# EAGLE design relayBoardSingleSMD (EAGLE 7.6.0)
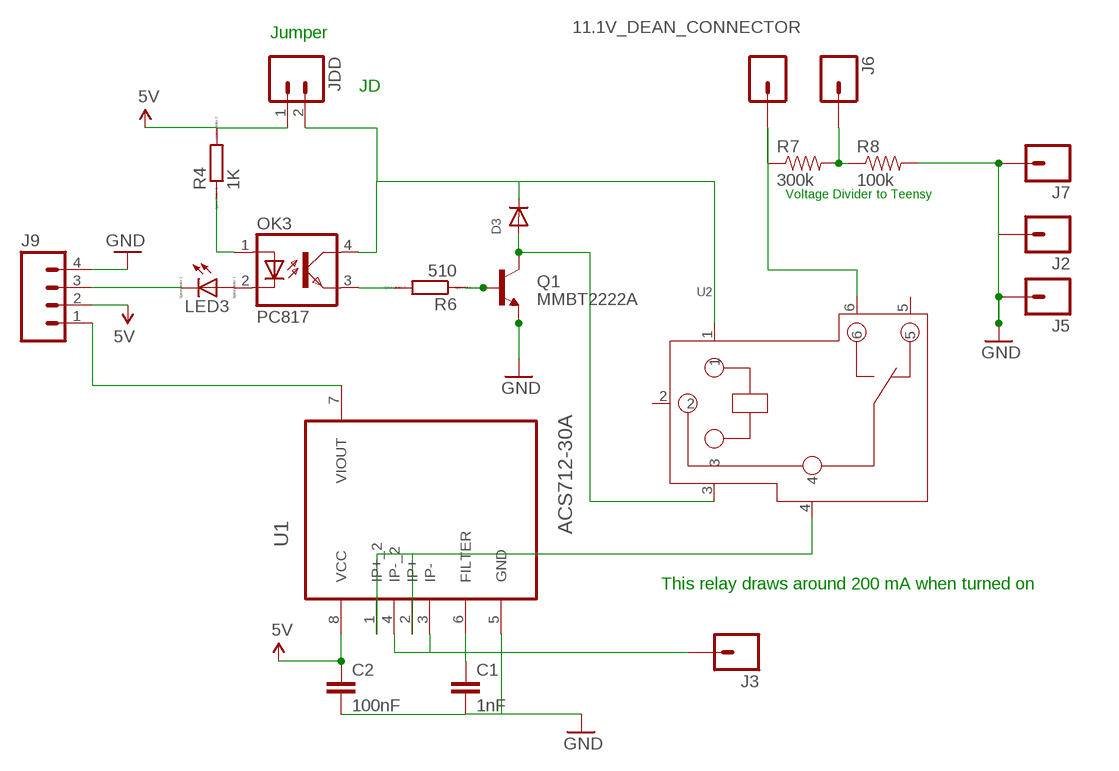
[diagram p0: schematic, sheet 1]

## Parts
11.1V_DEAN_CONNECTOR  M01NOSILK-KIT  [1X01NS-KIT]
C1  1nF  CAP1206  [1206]
C2  100nF  CAP1206  [1206]
D3  DIODEDO-1N4148  [DO-1N4148]
J2  M01NOSILK-KIT  [1X01NS-KIT]
J3  M01NOSILK-KIT  [1X01NS-KIT]
J5  M01NOSILK-KIT  [1X01NS-KIT]
J6  M01NOSILK-KIT  [1X01NS-KIT]
J7  M01NOSILK-KIT  [1X01NS-KIT]
J9  M04LOCK_LONGPADS  [1X04_LOCK_LONGPADS]
JDD  M02LOCK_LONGPADS  [1X02_LOCK_LONGPADS]
LED3  LED_E  [LED_1206]
OK3  PC817  [DIL04]
Q1  MMBT2222A  TRANSISTOR_NPNMMBT2222A  [SOT23-3]
R4  1K  RR1206  [R1206]
R6  510  RR1206  [R1206]
R7  300k  RESISTOR1206  [1206]
R8  100k  RESISTOR1206  [1206]
U1  ACS712-30A  ACS712ELCTR-20A-T  [SOIC127P600X175-8N]
U2  RELAY-SLA-05VDC-SL-C  [6P-19.8H]

## Nets
5V: C2.1 J9.2 JDD.1 R4.2 U1.8(VCC)
11.1V_BATTERY: 11.1V_DEAN_CONNECTOR.1 R7.1 U2.6
GND: C1.2 C2.2 J2.1 J5.1 J7.1 J9.4 Q1.2(E) R8.2 U1.5(GND)
N$19: LED3.A OK3.2(C)
N$20: OK3.1(A) R4.1
N$21: OK3.3(EMIT) R6.2
N$22: Q1.1(B) R6.1
N$23: D3.A Q1.3(C) U2.3
N$24: D3.C JDD.2 OK3.4(COL) U2.1
N$26: J3.1 U1.3(IP-) U1.4(IP-_2)
N$27: J9.3 LED3.C
N$68: C1.1 U1.6(FILTER)
N$69: J9.1 U1.7(VIOUT)
N$70: U1.1(IP+_2) U1.2(IP+) U2.4
VOLTAGE_DIVIDER_5V: J6.1 R7.2 R8.1
Unconnected: U2.2 U2.5

## Notes on the sheet
- Jumper
- JD
- Voltage Divider to Teensy
- This relay draws around 200 mA when turned on

## Library data of the parts
11.1V_DEAN_CONNECTOR J2 J3 J5-J7 = SparkFun-Connectors:M01: Header 1 Standard 1-pin 0.1" header. Use with straight break away headers (SKU : PRT-00116), right angle break away headers (PRT-00553), swiss pins (PRT-00743), machine pins (PRT-00117), and female headers (PRT-00115). SMTSO-256-ET is a "flush mount" nut for a 4-40 screw. The older package used to be too tight, and did not allow it to sit properly thru the drill hit. The latest (0.165DIA) fits nice and snug.
C1 C2 = SparkFun-Capacitors:CAP: Capacitor Standard 0603 ceramic capacitor, and 0.1" leaded capacitor.
D3 = adafruit:DIODE: Diode SMADIODE - SMA Surface Mount Package 20V 1A Schottky Diode Digikey: 641-1014-6-ND DO-1N4148 - Through Hole Small Current Diode SOD-123 20V 1 A (.5mV Vf) Schottky Diode - Digikey: MBRX120TPMSCT-ND SOD-323 10V 570mA (.38mV Vf, 3ns) Schottky Diode - Digikey: ZLLS410CT-ND SOD-523 30V 30mA Schottky Diode (RB751S-40TE61) - Digikey: RB751S-40TE61CT-ND SOT23-R/W - SOT23 Package (R = Solder Paste/Reflow Ovens, W = Hand-Soldering) BAT54Film 40V 300mA - Digikey: 497-7162-1-ND
J9 = SparkFun-Connectors:M04: Header 4 Standard 4-pin 0.1" header. Use with straight break away headers (SKU : PRT-00116), right angle break away headers (PRT-00553), swiss pins (PRT-00743), machine pins (PRT-00117), and female headers (PRT-00115). Molex polarized connector foot print use with SKU : PRT-08231 with associated crimp pins and housings. 1MM SMD Version SKU: PRT-10208; PROD_ID: CONN-09696
JDD = SparkFun-Connectors:M02: Standard 2-pin 0.1" header. Use with - straight break away headers ( PRT-00116) - right angle break away headers (PRT-00553) - swiss pins (PRT-00743) - machine pins (PRT-00117) - female headers (PRT-00115) Molex polarized connector foot print use with: PRT-08233 with associated crimp pins and housings. 2.54_SCREWTERM for use with PRT-10571. 3.5mm Screw Terminal footprints for PRT-08084 5mm Screw Terminal footprints for use with PRT-08432
LED3 = eagle-ltspice:LED_E: LED Source: http://www.osram.convergy.de Source: www.luxeon.com Source: www.kingbright.com; SPICEMODEL: NONE; SPICEPREFIX: D; SPICETYPE: diode
OK3 = optocoupler:PC817: SHARP OPTO COUPLER; MPN: PC817X4J000F; OC_FARNELL: 9707727; OC_NEWARK: 97K7059
Q1 = SparkFun-DiscreteSemi:TRANSISTOR_NPN: Generic NPN BJT MMBT2222A - TRANS-08049 (SOT-23, 1A 40V) MPSA42 - TRANS-09116 (SOT-23, 500mA 300V) MMBT5088LT1G - TRANS-11160 (SOT-23, 50 mA 30V) BC547 - COM-08928 <http://www.sparkfun.com/products/8928> (TO-92 45V 100mA) (1.Collector 2.Base 3.Emitter) 2N3904 - COM-00521 <http://www.sparkfun.com/products/521> (TO-92 40V 200mA) (1.Emitter 2.Base 3.Collector) P2N2222A - COM-12852 <http://www.sparkfun.com/products/12852> (TO-92 40V 600mA) (1.Collector 2.Base 3.Emitter); PROD_ID: TRANS-08049
R4 R6 = eagle-ltspice:R: RESISTOR, European symbol; SPICEMODEL: NONE; SPICEPREFIX: R
R7 R8 = SparkFun-Passives:RESISTOR: Resistor Basic schematic elements and footprints for 0603, 1206, and PTH resistors.
U1 = Allegro_By_element14_Batch_1:ACS712ELCTR-20A-T: Linear Current Sensor; MPN: ACS712ELCTR-20A-T; OC_FARNELL: 1329624; OC_NEWARK: 31M3133; PACKAGE: SOIC-8; SUPPLIER: Allegro
U2 = Grove ®C SPDT Relay(30A) v1.0:RELAY-SLA-05VDC-SL-C: · Up to 30A switching in SPST and 20A switching in spot arrangements. · Available as an open-frame relay, with a snap-on dust cover or with an immersion cleanable, plastic sealed case.

## Board
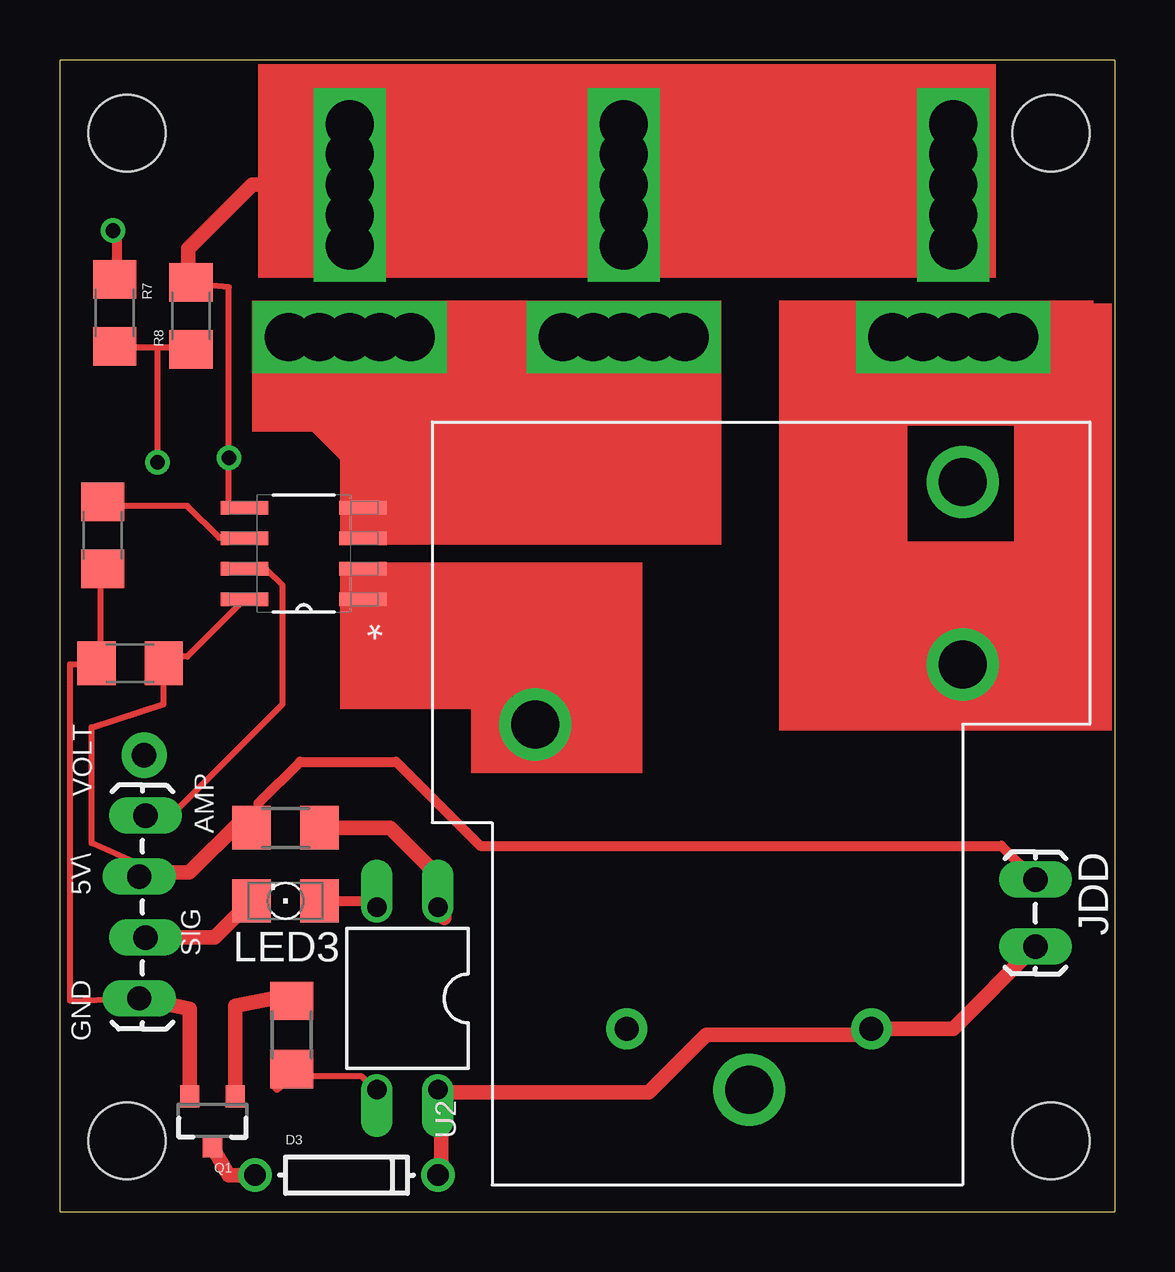
[diagram p1: board, top side]
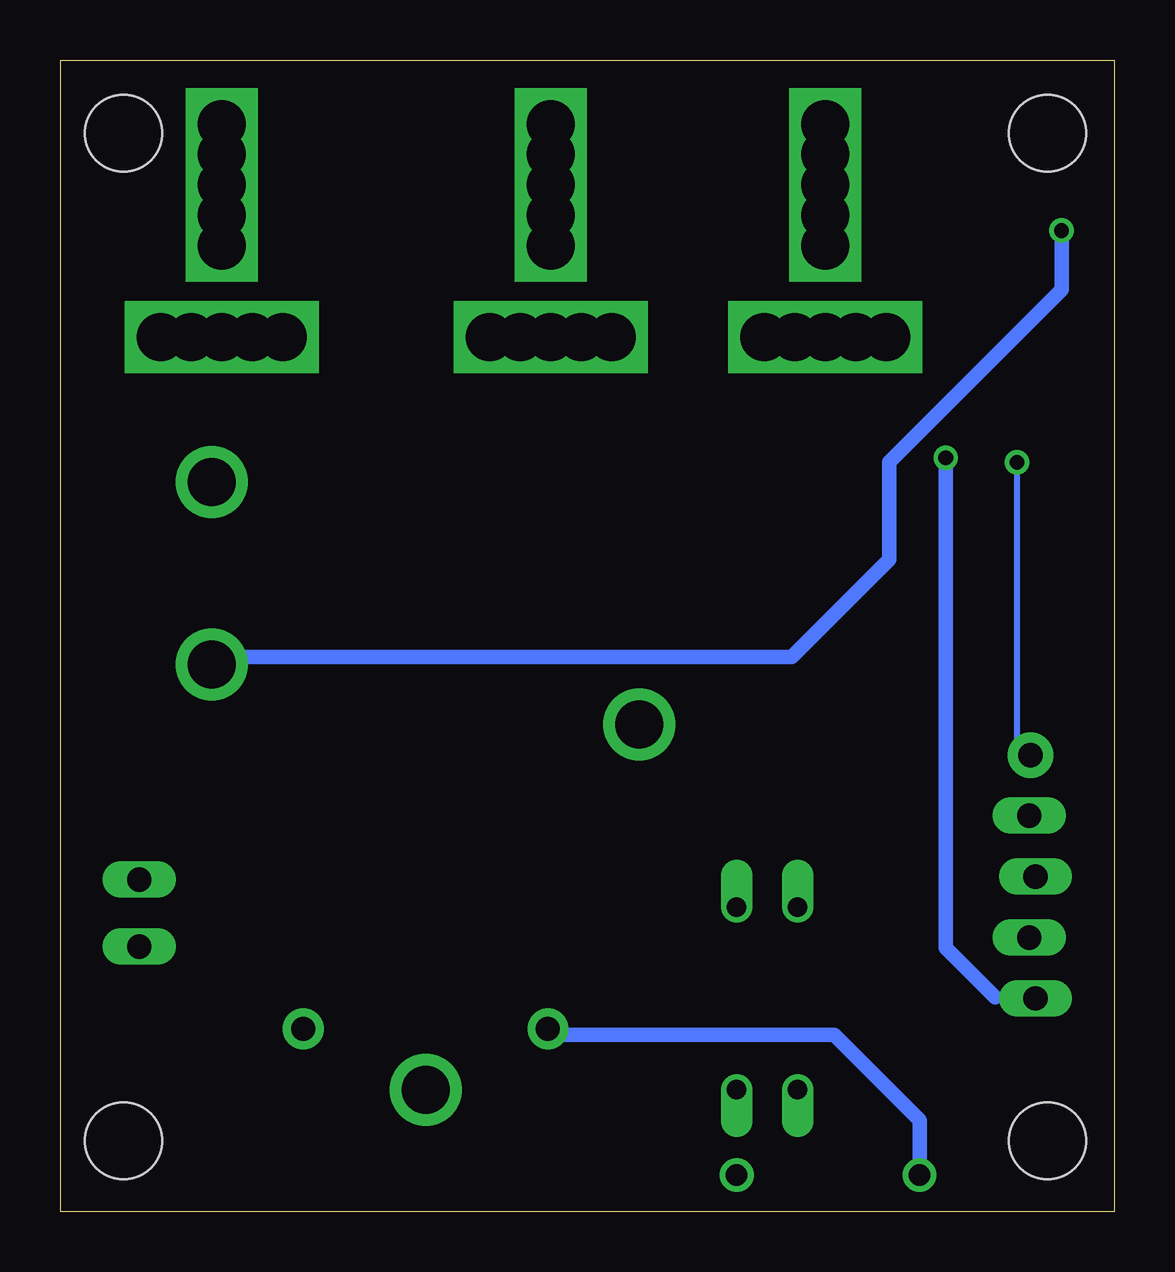
[diagram p2: board, bottom side, seen from below]

Size 43.94 x 48.01 mm. Coordinates in mm from the lower left corner, seen from the top.
Outline: 0,0 43.94,0 43.94,48.01 0,48.01 0,0
Copper layers (1*16): Top 0.035mm / dielectric 1.5mm / Bottom 0.035mm
Design rules "default *": minimum track width 10mil, minimum drill 24mil, track to track 16mil, track to pad 16mil, pad to pad 8mil, via to via 8mil, smd to smd 8mil, copper to edge 40mil, drill to drill 8mil, minimum pad ring 10mil, minimum via ring 8mil, stop-mask expansion 4mil, vias tented up to drill 0mil, thermal gap 10mil
Holes 3.2 mm at 2.79,44.96 41.29,44.96 41.29,2.96 2.79,2.96

### Footprints (pad centres in the part's own frame; a part is rotated, then mirrored left to right if it is on the bottom)
1X01NS-KIT = drill 1.016 pad 1.88: 1 0,0
1206 = smd 1.6 x 1.8: 1 -1.4,0; 2 1.4,0
DO-1N4148 = drill 0.9: A -3.81,0; C 3.81,0
1X04_LOCK_LONGPADS = drill 1.016 long: 1 0,0; 2 2.54,-0.254; 3 5.08,0; 4 7.62,-0.254
1X02_LOCK_LONGPADS = drill 1.016 long: 1 -0.127,0; 2 2.667,0
LED_1206 = smd 1.6 x 1.803: A -1.422,0; C 1.422,0
DIL04 = drill 0.813 offset: 1 -1.27,-3.81; 2 1.27,-3.81; 3 1.27,3.81; 4 -1.27,3.81
SOT23-3 = smd 0.8 x 0.9: 1 -0.95,-1; 2 0.95,-1; 3 0,1.1
R1206 = smd 1.6 x 1.803: 1 -1.422,0; 2 1.422,0
SOIC127P600X175-8N = smd 1.981 x 0.559: 1 -2.464,1.905; 2 -2.464,0.635; 3 -2.464,-0.635; 4 -2.464,-1.905; 5 2.464,-1.905; 6 2.464,-0.635; 7 2.464,0.635; 8 2.464,1.905
6P-19.8H = drill 1 pad 1.7: 1 -9.4,-4.6; 3 -9.4,5.6 | drill 2 pad 3: 2 -11.94,0.5; 4 3.3,9.4; 5 13.4,-8.4; 6 5.8,-8.4

### Placement (x,y rotation side)
11.1V_DEAN_CONNECTOR  39.75,36.45 90 top
C1  1.78,28.19 270 top
C2  2.92,22.86 180 top
D3  11.94,1.52 0 top
J2  23.5,42.8 270 top
J3  20.95,36.45 0 top
J5  37.21,42.62 0 top
J6  3.51,19.02 0 top
J7  12.06,42.8 270 top
J9  3.56,16.51 270 top
JDD  40.64,13.72 270 top
LED3  9.4,12.95 180 top
OK3  14.48,8.89 180 top
Q1  6.35,3.81 180 top
R4  9.4,16 180 top
R6  9.65,7.37 270 top
R7  2.29,37.46 270 top
R8  5.46,37.34 90 top
U1  10.16,27.43 180 top
U2  29.21,17.02 90 top

### Tracks (layer width: path | path; a pad name or v marks a point on that pad's centre or on a via)
5V
  Top 0.254: U1.8 5.31,23.14 4.65,23.14 C2.1 4.32,22.81 4.32,21.16 1.32,20.19 1.32,15.37 4.06,14.15 J9.2 | 40.64,13.89 JDD.1 | 8.28,16.21 R4.2
  Top 0.406: 8.28,16.21 8.28,17.03 10,18.75 14,18.75 17.5,15.25 39.23,15.25 JDD.1
  Top 0.61: 4.06,14.15 5.39,14.15 7.5,16.25 7.72,16.25 R4.2
11.1V_BATTERY  (via drill 0.61)
  Top 0.254: 2.39,39.12 2.34,38.66 R7.1
  Top 0.406: 11.1V_DEAN_CONNECTOR.1 39.75,35.69 41.91,33.53 41.91,25.91 38.1,22.1 | 36.83,23.37 38.1,22.1 | 38.1,22.1 38.1,22.33 U2.6 | 2.39,39.12 2.39,40.72 v2.21,40.89
  Bottom 0.254: 18.85,23.14 37.34,23.14 U2.6
  Bottom 0.61: v2.21,40.89 2.21,38.43 9.4,31.24 9.4,27.18 13.46,23.11 37.31,23.11 U2.6
GND  (via drill 0.61)
  Top 0.254: U1.5 7.04,29.49 v7.04,31.42 7.04,38.53 5.64,38.66 R8.2 | C1.2 1.68,26.77 1.68,23.14 C2.2 0.41,22.81 0.41,8.79 4.32,8.94 J9.4
  Top 0.61: J7.1 8,42.8 5.33,40.13 5.33,38.86 R8.2 | Q1.2 5.4,8.45 J9.4
  Top 2.54: J7.1 J2.1 36.45,42.8 J5.1
  Bottom 0.254: 4.98,8.94 4.32,8.94 J9.4
  Bottom 0.61: v7.04,31.42 7.04,11 4.98,8.94
N$2  (via drill 2)
  other vias: 26.04,36.45
N$3  (via drill 2)
  other vias: 24.77,36.45
N$4  (via drill 2)
  other vias: 23.5,36.45
N$5  (via drill 2)
  other vias: 22.23,36.45
N$6  (via drill 2)
  other vias: 20.95,36.45
N$7  (via drill 2)
  other vias: 23.5,40.26
N$8  (via drill 2)
  other vias: 23.5,41.53
N$9  (via drill 2)
  other vias: 23.5,42.8
N$10  (via drill 2)
  other vias: 23.5,44.07
N$11  (via drill 2)
  other vias: 23.5,45.34
N$12  (via drill 2)
  other vias: 14.61,36.45
N$13  (via drill 2)
  other vias: 13.34,36.45
N$14  (via drill 2)
  other vias: 12.06,36.45
N$15  (via drill 2)
  other vias: 10.79,36.45
N$16  (via drill 2)
  other vias: 9.53,36.45
N$17  (via drill 2)
  other vias: 12.06,40.26
N$18  (via drill 2)
  other vias: 12.06,41.53
N$19
  Top 0.406: LED3.A 13.21,12.95 OK3.2
N$20
  Top 0.61: R4.1 13.75,16 16,13.75 16,12.45 | 16,12.25 16,12.45 | 16,12.45 OK3.1
N$21
  Top 0.254: 13.18,4.98 OK3.3 12.9,5.31 12.57,5.64 9.93,5.64 R6.2
  Top 0.406: R6.2 9.04,5.18
N$22
  Top 0.61: Q1.1 7.3,8.57 8.89,8.89 9.55,8.89 R6.1
N$23
  Top 0.61: D3.A 7.03,1.52 Q1.3
  Bottom 0.61: D3.A 8.13,3.81 11.68,7.37 23.36,7.37 U2.3
N$24
  Top 0.254: 15.88,4.98 OK3.4 | 15.88,1.68 D3.C
  Top 0.61: 15.88,4.98 24.54,4.98 26.92,7.37 33.56,7.37 U2.1 37.21,7.62 JDD.2 | 15.88,1.68 15.88,4.95 OK3.4
N$26
  Top 0.406: U1.3 12.62,28.83 U1.4
  Top 1.676: 9.27,36.45 9.27,34.92 12.57,31.62 12.57,28.88 12.62,28.83
  Top 2.54: 9.27,36.45 J3.1
N$27
  Top 0.61: J9.3 6.45,11.43 LED3.C
N$29  (via drill 2)
  other vias: 12.06,42.8
N$30  (via drill 2)
  other vias: 12.06,44.07
N$51  (via drill 2)
  other vias: 39.75,36.45
N$52  (via drill 2)
  other vias: 38.48,36.45
N$53  (via drill 2)
  other vias: 37.21,36.45
N$54  (via drill 2)
  Top 0.61: v34.67,36.45 v35.94,36.45
N$56  (via drill 2)
  other vias: 37.21,40.26
N$57  (via drill 2)
  other vias: 37.21,41.53
N$58  (via drill 2)
  other vias: 37.21,42.8
N$59  (via drill 2)
  other vias: 37.21,44.07
N$60  (via drill 2)
  other vias: 37.21,45.34
N$62  (via drill 2)
  other vias: 12.06,45.34
N$68
  Top 0.254: C1.1 2.01,29.41 5.31,29.41 6.63,28.09 7.62,28.09 U1.6
N$69
  Top 0.254: U1.7 7.95,26.77 8.61,26.77 9.27,26.11 9.27,21.16 4.65,16.54 J9.1
N$70
  Top 0.406: U1.2 12.62,26.04 U1.1 | U2.4 19.81,22.1 17.65,24.26 12.7,24.26
  Top 1.676: 12.7,24.26 12.7,25.96 12.62,26.04
VOLTAGE_DIVIDER_5V  (via drill 0.61)
  Top 0.254: 4.06,36.02 5.31,36.02 R8.1 | 4.06,36.02 2.34,36.02 R7.2 | v4.06,31.24 4.06,36.02 | 3.63,18.92 J6.1
  Bottom 0.254: v4.06,31.24 4.06,18.92 J6.1
(copper drawn outside any net)
  shapes: Top area x9

### Text on the board
tNames: VOLT | AMP | 5V\ | SIG | GND